# Altium schematic sheet IO.SchDoc
size A4; SheetNumber: 4; SheetTotal: 5; SPICEModelCacheOQHKHOHZ: <root> / <DocumentId>OQHKHOHZ</DocumentId> / <CacheFrame Number="0"> / <Model Name="2n3904" Kind="MDL"> / <Text>*2N3904 / *Si 310mW  40V 200mA 300MHz pkg:TO-92B 1,2,3 / .MODEL 2N3904 NPN(IS=1.4E-14 BF=300 VAF=100 IKF=0.025 ISE=3E-13 / + BR=7.5 RC=2.4 CJE=4.5E-12 TF=4E-10 CJC=3.5E-12 TR=2.1E-8 XTB=1.5 KF=9E-16 )</Text> / </Model> / </CacheFrame> / </root>
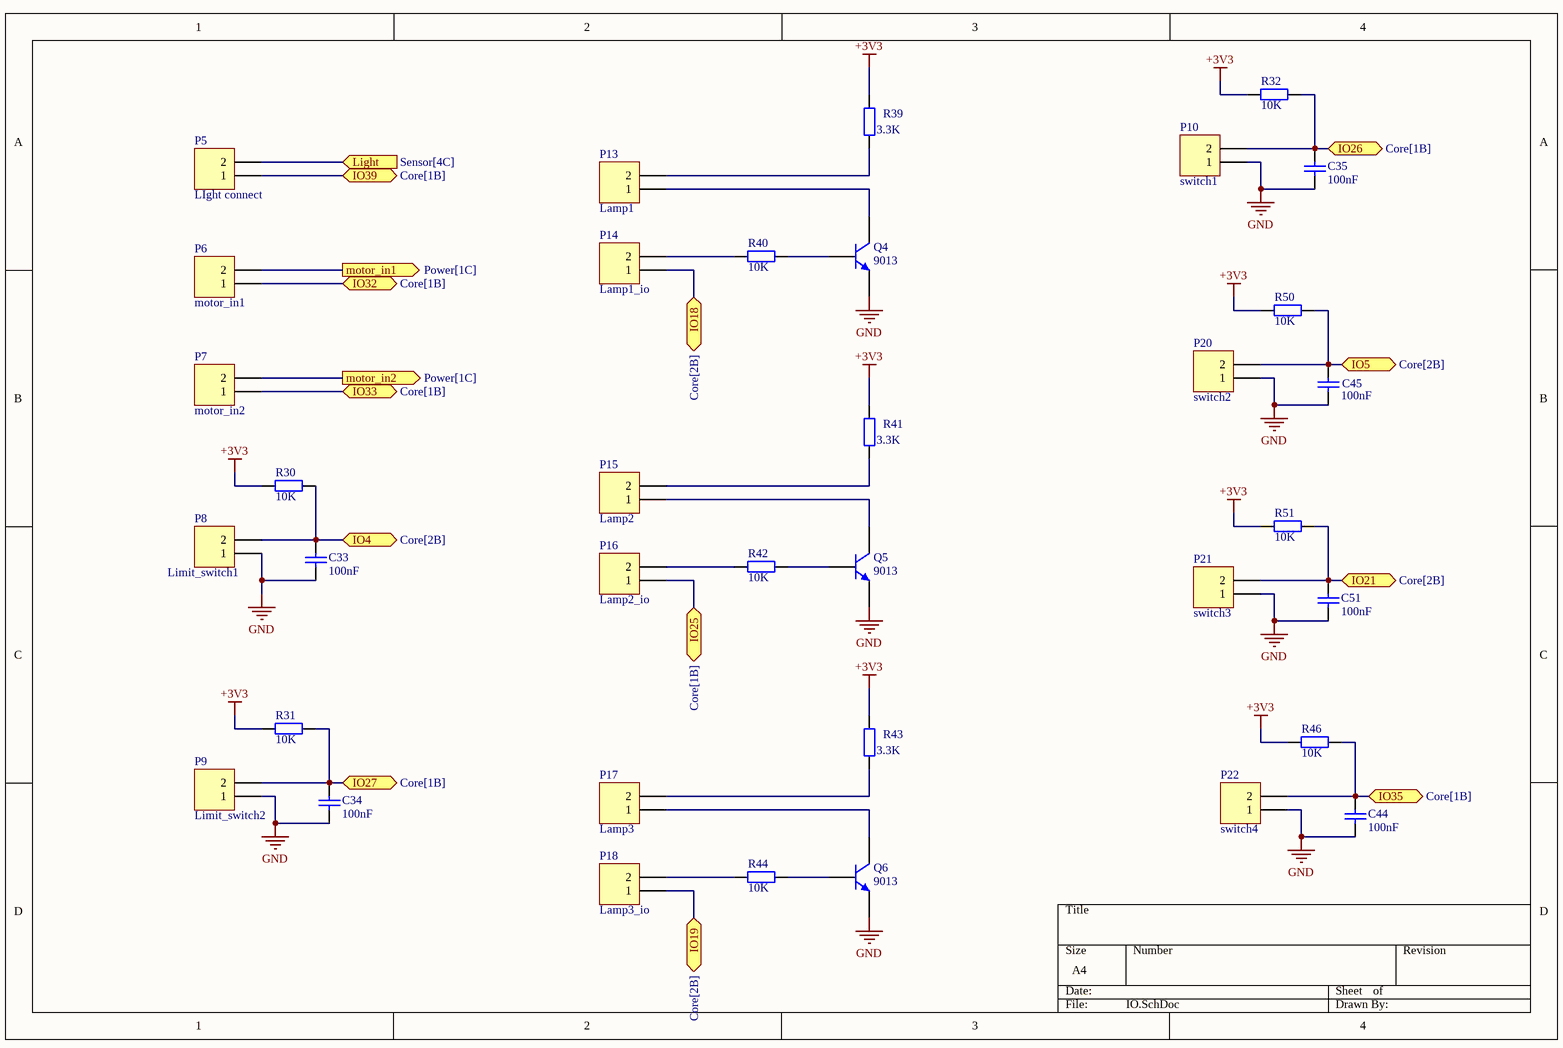
[diagram p0: IO.SchDoc]

## Parts
C33  value 100nF  [6-0805_N]  (hidden comment: Cap)
C34  value 100nF  [6-0805_N]  (hidden comment: Cap)
C35  value 100nF  [6-0805_N]  (hidden comment: Cap)
C44  value 100nF  [6-0805_N]  (hidden comment: Cap)
C45  value 100nF  [6-0805_N]  (hidden comment: Cap)
C51  value 100nF  [6-0805_N]  (hidden comment: Cap)
P5  LIght connect  [HDR1X2]
P6  motor_in1  [HDR1X2]
P7  motor_in2  [HDR1X2]
P8  Limit_switch1  [HDR1X2]
P9  Limit_switch2  [HDR1X2]
P10  switch1  [HDR1X2]
P13  Lamp1  [HDR1X2]
P14  Lamp1_io  [HDR1X2]
P15  Lamp2  [HDR1X2]
P16  Lamp2_io  [HDR1X2]
P17  Lamp3  [HDR1X2]
P18  Lamp3_io  [HDR1X2]
P20  switch2  [HDR1X2]
P21  switch3  [HDR1X2]
P22  switch4  [HDR1X2]
Q4  9013  [SOT-23-3_L2.9-W1.3-P1.90-LS2.4-BR]
Q5  9013  [SOT-23-3_L2.9-W1.3-P1.90-LS2.4-BR]
Q6  9013  [SOT-23-3_L2.9-W1.3-P1.90-LS2.4-BR]
R30  value 10K  [6-0805_N]  (hidden comment: Res2)
R31  value 10K  [6-0805_N]  (hidden comment: Res2)
R32  value 10K  [6-0805_N]  (hidden comment: Res2)
R39  value 3.3K  [6-0805_N]  (hidden comment: Res2)
R40  value 10K  [6-0805_N]  (hidden comment: Res2)
R41  value 3.3K  [6-0805_N]  (hidden comment: Res2)
R42  value 10K  [6-0805_N]  (hidden comment: Res2)
R43  value 3.3K  [6-0805_N]  (hidden comment: Res2)
R44  value 10K  [6-0805_N]  (hidden comment: Res2)
R46  value 10K  [6-0805_N]  (hidden comment: Res2)
R50  value 10K  [6-0805_N]  (hidden comment: Res2)
R51  value 10K  [6-0805_N]  (hidden comment: Res2)

## Ports
IO4 (bidir, see Core[2B]), IO5 (bidir, see Core[2B]), IO18 (bidir, see Core[2B]), IO19 (bidir, see Core[2B]), IO21 (bidir, see Core[2B]), IO25 (bidir, see Core[1B]), IO26 (bidir, see Core[1B]), IO27 (bidir, see Core[1B]), IO32 (bidir, see Core[1B]), IO33 (bidir, see Core[1B]), IO35 (bidir, see Core[1B]), IO39 (bidir, see Core[1B]), Light (in, see Sensor[4C]), motor_in1 (out, see Power[1C]), motor_in2 (out, see Power[1C])

## Nets
+3V3: R30.1 R31.1 R32.1 R39.1 R41.1 R43.1 R46.1 R50.1 R51.1
GND: C33.1 C34.1 C35.1 C44.1 C45.1 C51.1 P8.1 P9.1 P10.1 P20.1 P21.1 P22.1 Q4.1(E) Q5.1(E) Q6.1(E)
IO4: C33.2 P8.2 R30.2 ; port IO4
IO5: C45.2 P20.2 R50.2 ; port IO5
IO18: P14.1 ; port IO18
IO19: P18.1 ; port IO19
IO21: C51.2 P21.2 R51.2 ; port IO21
IO25: P16.1 ; port IO25
IO26: C35.2 P10.2 R32.2 ; port IO26
IO27: C34.2 P9.2 R31.2 ; port IO27
IO32: P6.1 ; port IO32
IO33: P7.1 ; port IO33
IO35: C44.2 P22.2 R46.2 ; port IO35
IO39: P5.1 ; port IO39
Light: P5.2 ; port Light
motor_in1: P6.2 ; port motor_in1
motor_in2: P7.2 ; port motor_in2
NetP13_1: P13.1 Q4.3(C)
NetP13_2: P13.2 R39.2
NetP14_2: P14.2 R40.1
NetP15_1: P15.1 Q5.3(C)
NetP15_2: P15.2 R41.2
NetP16_2: P16.2 R42.1
NetP17_1: P17.1 Q6.3(C)
NetP17_2: P17.2 R43.2
NetP18_2: P18.2 R44.1
NetQ4_2: Q4.2(B) R40.2
NetQ5_2: Q5.2(B) R42.2
NetQ6_2: Q6.2(B) R44.2

## Library data of the parts
C33-C35 C44 C45 C51 = Cap: Capacitor; Published: 8-Jun-2000; LatestRevisionDate: 17-Jul-2002; LatestRevisionNote: Re-released for DXP Platform.; PackageReference: RAD-0.3; Publisher: Altium Limited; PackageDescription: Radial Cap, Thru-Hole; 2 Leads; 0.3 in Pin Spacing
P5-P10 P13-P18 P20-P22 = Header 2: Header, 2-Pin; LatestRevisionDate: 17-Jul-2002; LatestRevisionNote: Re-released for DXP Platform.; Publisher: Altium Limited
Q4-Q6 = 2N3904: NPN General Purpose Amplifier; Published: 8-Jun-2000; LatestRevisionDate: 15-Jan-2003; LatestRevisionNote: PCB Footprint 'BCY-W3/D4.7' replaced; DatasheetVersion: 1997; PackageVersion: Sep-1998; PackageReference: TO-92A; Publisher: Altium Limited; PackageDescription: TO, Flat Index; 3 In-Line, Axial Leads; Body Dia. 4.5mm; Leads 0.51 x 0.48 mm (max); ComponentLink1Description: Manufacturer Link; ComponentLink1URL: http://www.fairchildsemi.com/; ComponentLink2Description: Datasheet; ComponentLink2URL: http://www.fairchildsemi.com/ds/2N%2F2N3904.pdf
R30-R32 R39-R44 R46 R50 R51 = Res2: Resistor; Published: 8-Jun-2000; LatestRevisionDate: 17-Jul-2002; LatestRevisionNote: Re-released for DXP Platform.; PackageReference: AXIAL-0.4; Publisher: Altium Limited; PackageDescription: Axial Device, Thru-Hole; 2 Leads; 0.4 in Pin Spacing